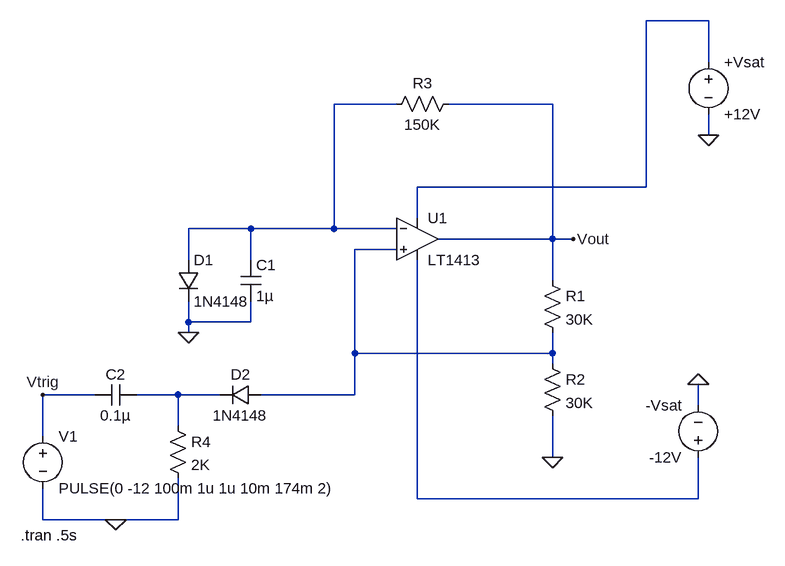
[diagram p0: schematic OPAMP_Monostable_multivibrator.asc]
OPAMP_Monostable_multivibrator.asc, the LTspice schematic file:
Version 4
SHEET 1 880 680
WIRE 624 -176 528 -176
WIRE 624 -112 624 -176
WIRE 144 -48 48 -48
WIRE 384 -48 224 -48
WIRE 624 0 624 -32
WIRE 528 80 528 -176
WIRE 528 80 176 80
WIRE 176 128 176 80
WIRE -80 144 -176 144
WIRE 48 144 48 -48
WIRE 48 144 -80 144
WIRE 144 144 48 144
WIRE 384 160 384 -48
WIRE 384 160 208 160
WIRE 416 160 384 160
WIRE 144 176 80 176
WIRE -176 192 -176 144
WIRE -80 192 -80 144
WIRE 384 224 384 160
WIRE -176 288 -176 256
WIRE -80 288 -80 256
WIRE -80 288 -176 288
WIRE -176 304 -176 288
WIRE 80 336 80 176
WIRE 384 336 384 304
WIRE 384 336 80 336
WIRE 384 352 384 336
WIRE -320 400 -400 400
WIRE -192 400 -256 400
WIRE -128 400 -192 400
WIRE 80 400 80 336
WIRE 80 400 -64 400
WIRE 608 416 608 384
WIRE -192 448 -192 400
WIRE -400 464 -400 400
WIRE 384 496 384 432
WIRE 176 560 176 192
WIRE 608 560 608 496
WIRE 608 560 176 560
WIRE -400 592 -400 544
WIRE -288 592 -400 592
WIRE -192 592 -192 528
WIRE -192 592 -288 592
FLAG -176 304 0
FLAG -288 592 0
FLAG 384 496 0
FLAG 416 160 Vout
FLAG 624 0 0
FLAG 608 384 0
FLAG -400 400 Vtrig
SYMBOL OpAmps\\LT1413 176 96 R0
SYMATTR InstName U1
SYMBOL diode -192 192 R0
SYMATTR InstName D1
SYMATTR Value 1N4148
SYMBOL cap -96 192 R0
SYMATTR InstName C1
SYMATTR Value 1µ
SYMBOL diode -64 384 R90
WINDOW 0 0 32 VBottom 2
WINDOW 3 32 32 VTop 2
SYMATTR InstName D2
SYMATTR Value 1N4148
SYMBOL res -208 432 R0
SYMATTR InstName R4
SYMATTR Value 2K
SYMBOL cap -256 384 R90
WINDOW 0 0 32 VBottom 2
WINDOW 3 32 32 VTop 2
SYMATTR InstName C2
SYMATTR Value 0.1µ
SYMBOL voltage -400 448 R0
WINDOW 123 0 0 Left 0
WINDOW 39 0 0 Left 0
SYMATTR InstName V1
SYMATTR Value PULSE(0 -12 100m 1u 1u 10m 174m 2)
SYMBOL res 368 208 R0
SYMATTR InstName R1
SYMATTR Value 30K
SYMBOL res 368 336 R0
SYMATTR InstName R2
SYMATTR Value 30K
SYMBOL res 240 -64 R90
WINDOW 0 0 56 VBottom 2
WINDOW 3 32 56 VTop 2
SYMATTR InstName R3
SYMATTR Value 150K
SYMBOL voltage 624 -128 R0
WINDOW 123 0 0 Left 0
WINDOW 39 0 0 Left 0
SYMATTR InstName +Vsat
SYMATTR Value +12V
SYMBOL voltage 608 512 R180
WINDOW 0 24 96 Left 2
WINDOW 3 24 16 Left 2
SYMATTR InstName -Vsat
SYMATTR Value -12V
TEXT -434 616 Left 2 !.tran .5s

The netlist it stands for:
* OPAMP_Monostable_multivibrator.asc
XU1 N003 N002 N001 N005 Vout LT1413  ; pins In+ In- V+ V- OUT
D1 N002 0 1N4148
C1 N002 0 1µ
D2 N003 N004 1N4148
R4 N004 0 2K
C2 N004 Vtrig 0.1µ
V1 Vtrig 0 PULSE(0 -12 100m 1u 1u 10m 174m 2)
R1 Vout N003 30K
R2 N003 0 30K
R3 Vout N002 150K
V§+Vsat N001 0 +12V
V§-Vsat N005 0 -12V
.model D D
.lib standard.dio
.tran .5s
.lib LTC.lib
.backanno
.end